# Altium schematic sheet ACD_PVW01_PVWires.SchDoc
size Letter; DocumentNumber: ACD_PVW01_PVWires; SheetNumber: 1; SheetTotal: 1
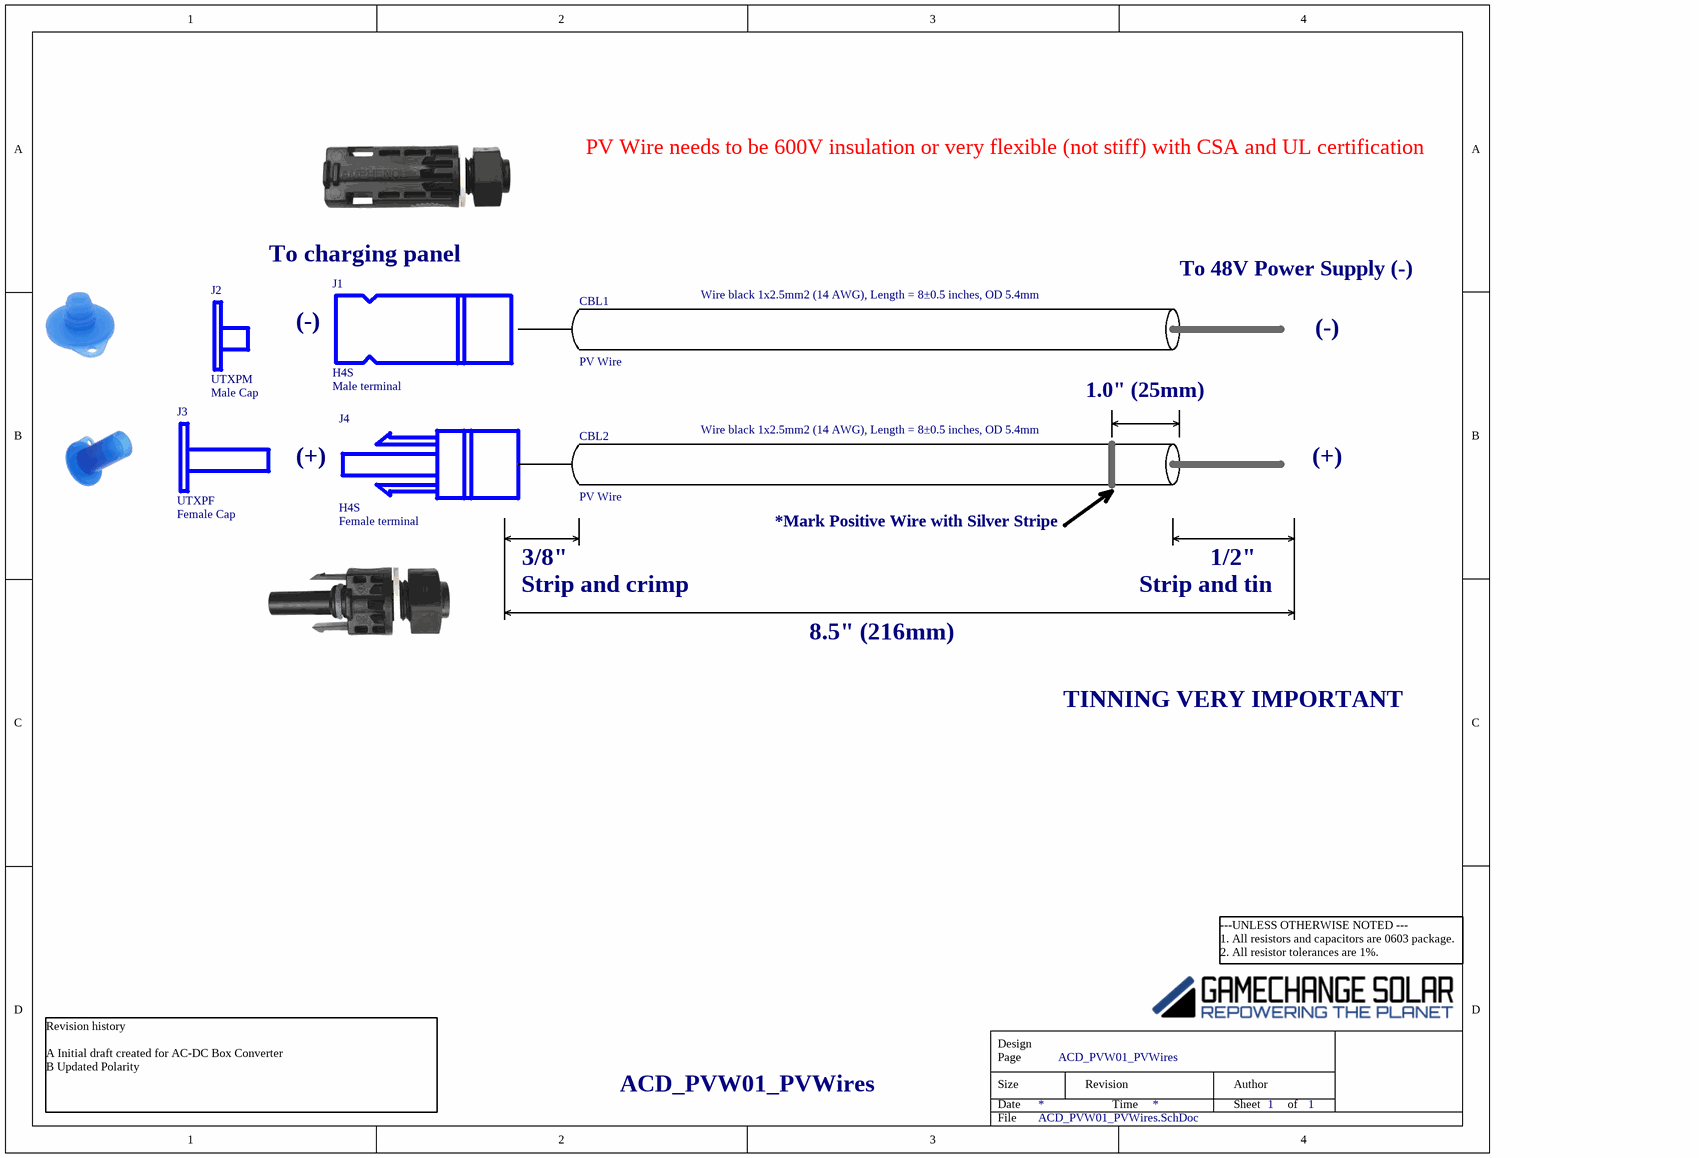
[diagram p0: ACD_PVW01_PVWires.SchDoc]

## Parts
CBL1  PV Wire
CBL2  PV Wire
J1  H4S  Package: Male terminal
J2  UTXPM  Package: Male Cap
J3  UTXPF  Package: Female Cap
J4  H4S  Package: Female terminal

## Notes on the sheet
- PV Wire needs to be 600V insulation or very flexible (not stiff) with CSA and UL certification
- (near J1) To charging panel
- (near CBL1) Wire black 1x2.5mm2 (14 AWG), Length = 8±0.5 inches, OD 5.4mm
- To 48V Power Supply (-)
- (near J1) (-)
- (-)
- (near CBL2) Wire black 1x2.5mm2 (14 AWG), Length = 8±0.5 inches, OD 5.4mm
- 1.0" (25mm)
- (+)
- 3/8"
- *Mark Positive Wire with Silver Stripe
- 1/2"
- Strip and crimp
- 8.5" (216mm)
- Strip and tin
- TINNING VERY IMPORTANT
- Revision history
  A Initial draft created for AC-DC Box Converter
  B Updated Polarity
- ---UNLESS OTHERWISE NOTED ---
  1. All resistors and capacitors are 0603 package.
  2. All resistor tolerances are 1%.
- Design
- Size
- Date
- Page
- Revision
- Time
- Sheet
- Author
- of
- File

## Library data of the parts
CBL1 CBL2 = Wire,AC-DC: PV wire, UL 4703, single conductor, stranded wire, BLACK. 1x2.5mm2 (14 AWG), Length = 8±0.5 inches, OD 5.40 mm / Material: XLPO; MFR1: Leader Technology (Shenzen) Co., Limited; MPN1: H1Z2Z2-K 1x2.5mm²; GCS PN: WIRHF00480-850BA
J1 = CON, PV, Male: PV connector Male Coupler Connector Plus 14 AWG; MFR1: Amphenol; MPN1: H4SMM2DM; GCS PN: CONCM00293-H4SMA; Supplier info: *
J2 = CON, PV, Male_ProtectiveCap_1: Protective Cap Connector Plus 10 ~ 14 AWG; MFR1: Amphenol; GCS PN: CONPF00296-TXPM; MPN1: UTXPM; Supplier info: *
J3 = CON, PV, Female_ProtectiveCap: Protective Cap Connector Plus 10 ~ 14 AWG; MFR1: Amphenol; GCS PN: CONPF00295-TXPF; MPN1: UTXPF; Supplier info: *
J4 = CON, PV, Female: PV connector Female Coupler Connector Plus 14 AWG; MFR1: Amphenol; MPN1: H4SFM2DM; GCS PN: CONCF00292-H4SFA; Supplier info: *